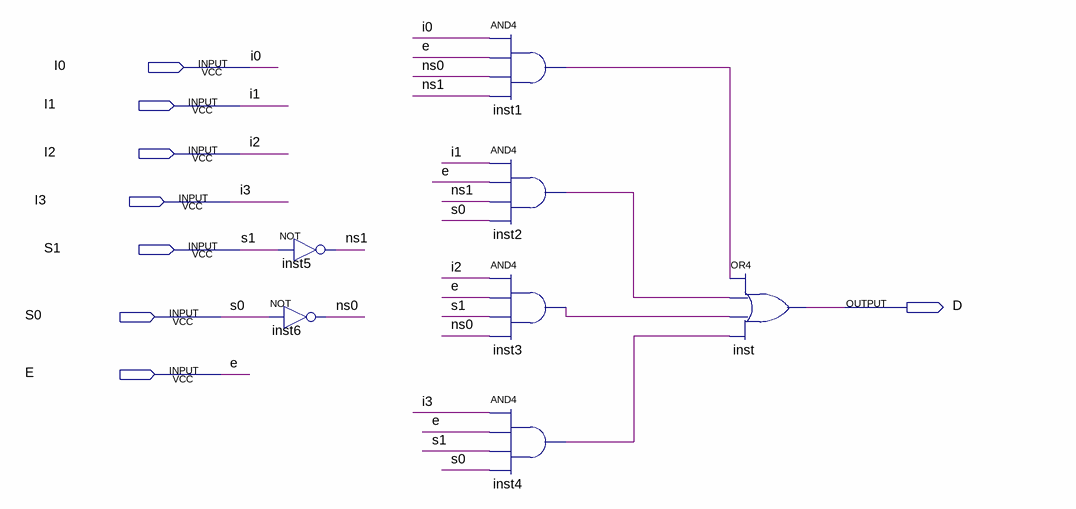
[diagram p0: schematic sheet]
// Quartus schematic MPX2.bdf as structural Verilog: 7 symbols, 8 pins
module MPX2 (
  input  I0,
  input  I1,
  input  I2,
  input  I3,
  input  S1,
  input  S0,
  input  E,
  output D
);

  wire inst1_out, inst2_out, inst3_out, inst4_out, ns0, ns1;

  not inst5 (ns1, S1);
  not inst6 (ns0, S0);
  and inst1 (inst1_out, I0, E, ns0, ns1);
  and inst2 (inst2_out, I1, E, ns1, S0);
  and inst3 (inst3_out, I2, E, S1, ns0);
  and inst4 (inst4_out, I3, E, S1, S0);
  or inst (D, inst1_out, inst2_out, inst3_out, inst4_out);
endmodule
